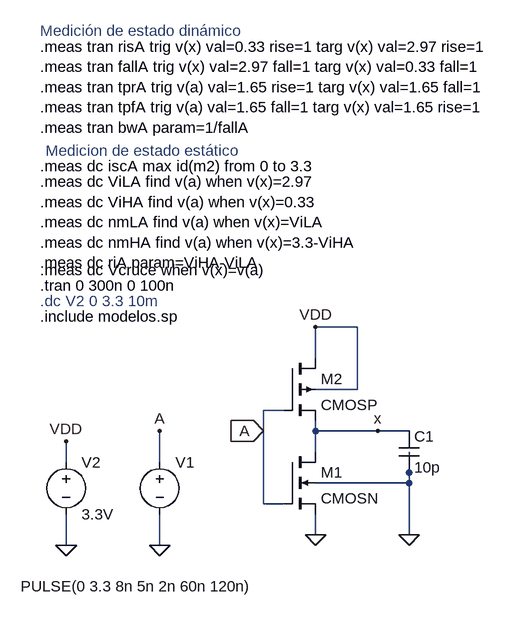
[diagram p0: schematic Inversor.asc]
Inversor.asc, the LTspice schematic file:
Version 4
SHEET 1 1388 680
WIRE 368 16 304 16
WIRE 304 64 304 16
WIRE 368 112 368 16
WIRE 368 112 304 112
WIRE 256 144 224 144
WIRE 224 176 224 144
WIRE 304 176 304 160
WIRE 400 176 304 176
WIRE 448 176 400 176
WIRE 304 208 304 176
WIRE -80 224 -80 192
WIRE 64 224 64 176
WIRE 448 240 448 208
WIRE 448 256 448 240
WIRE 448 256 304 256
WIRE 224 288 224 176
WIRE 256 288 224 288
WIRE 304 336 304 304
WIRE 448 336 448 256
WIRE -80 352 -80 304
WIRE 64 352 64 304
FLAG 64 352 0
FLAG 304 336 0
FLAG 448 336 0
FLAG -80 192 VDD
FLAG 304 16 VDD
FLAG 64 176 A
FLAG 224 176 A
IOPIN 224 176 In
FLAG -80 352 0
FLAG 400 176 x
SYMBOL nmos4 256 208 R0
SYMATTR InstName M1
SYMATTR Value CMOSN
SYMATTR Value2 l=0.6u w=7.5u
SYMBOL pmos4 256 64 R0
SYMATTR InstName M2
SYMATTR Value CMOSP
SYMATTR Value2 l=.6u w=26.7u
SYMBOL voltage 64 208 R0
WINDOW 3 -214 207 Left 2
WINDOW 123 0 0 Left 0
WINDOW 39 0 0 Left 0
SYMATTR Value PULSE(0 3.3 8n 5n 2n 60n 120n)
SYMATTR InstName V1
SYMBOL voltage -80 208 R0
WINDOW 123 0 0 Left 0
WINDOW 39 0 0 Left 0
SYMATTR InstName V2
SYMATTR Value 3.3V
SYMBOL cap 432 176 R0
SYMATTR InstName C1
SYMATTR Value 10p
TEXT -120 0 Left 2 !.include modelos.sp
TEXT -120 -48 Left 2 !.tran 0 300n 0 100n
TEXT -120 -24 Left 2 ;.dc V2 0 3.3 10m
TEXT -120 -72 Left 2 !.meas dc Vcruce when v(x)=v(a)
TEXT -120 -208 Left 2 !.meas dc ViLA find v(a) when v(x)=2.97\n.meas dc ViHA find v(a) when v(x)=0.33\n.meas dc nmLA find v(a) when v(x)=ViLA\n.meas dc nmHA find v(a) when v(x)=3.3-ViHA\n.meas dc riA param=ViHA-ViLA
TEXT -120 -232 Left 2 !.meas dc iscA max id(m2) from 0 to 3.3
TEXT -120 -416 Left 2 !.meas tran risA trig v(x) val=0.33 rise=1 targ v(x) val=2.97 rise=1\n.meas tran fallA trig v(x) val=2.97 fall=1 targ v(x) val=0.33 fall=1\n.meas tran tprA trig v(a) val=1.65 rise=1 targ v(x) val=1.65 fall=1\n.meas tran tpfA trig v(a) val=1.65 fall=1 targ v(x) val=1.65 rise=1\n.meas tran bwA param=1/fallA
TEXT -112 -256 Left 2 ;Medicion de estado estático
TEXT -120 -440 Left 2 ;Medición de estado dinámico

The netlist it stands for:
* Inversor.asc
M1 x A 0 0 CMOSN l=0.6u w=7.5u
M2 VDD A x VDD CMOSP l=.6u w=26.7u
V1 A 0 PULSE(0 3.3 8n 5n 2n 60n 120n)
V2 VDD 0 3.3V
C1 x 0 10p
.model NMOS NMOS
.model PMOS PMOS
.lib standard.mos
.include modelos.sp
.tran 0 300n 0 100n
* .dc V2 0 3.3 10m
.meas dc Vcruce when v(x)=v(a)
.meas dc ViLA find v(a) when v(x)=2.97
.meas dc ViHA find v(a) when v(x)=0.33
.meas dc nmLA find v(a) when v(x)=ViLA
.meas dc nmHA find v(a) when v(x)=3.3-ViHA
.meas dc riA param=ViHA-ViLA
.meas dc iscA max id(m2) from 0 to 3.3
.meas tran risA trig v(x) val=0.33 rise=1 targ v(x) val=2.97 rise=1
.meas tran fallA trig v(x) val=2.97 fall=1 targ v(x) val=0.33 fall=1
.meas tran tprA trig v(a) val=1.65 rise=1 targ v(x) val=1.65 fall=1
.meas tran tpfA trig v(a) val=1.65 fall=1 targ v(x) val=1.65 rise=1
.meas tran bwA param=1/fallA
* Medicion de estado estático
* Medición de estado dinámico
.backanno
.end